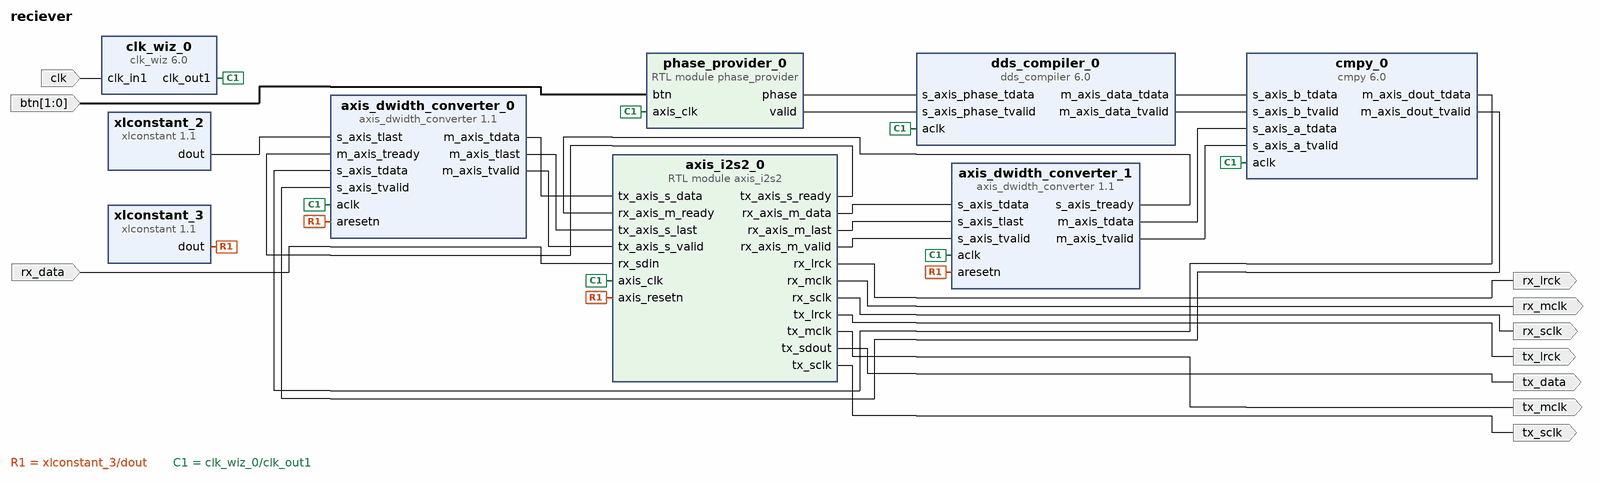
[diagram p0: block diagram of the top level]
# Vivado block design reciever, xc7s50csga324-1, Vivado 2023.2
create_bd_design reciever

create_bd_port -dir I -type clk clk
create_bd_port -dir O tx_mclk
create_bd_port -dir O tx_lrck
create_bd_port -dir O tx_sclk
create_bd_port -dir O tx_data
create_bd_port -dir O rx_mclk
create_bd_port -dir O rx_lrck
create_bd_port -dir O rx_sclk
create_bd_port -dir I rx_data
create_bd_port -dir I -from 1 -to 0 btn

create_bd_cell -type module -reference axis_i2s2 axis_i2s2_0
create_bd_cell -type ip -vlnv xilinx.com:ip:clk_wiz:6.0 clk_wiz_0
set_property -dict [list \
  CONFIG.CLKOUT1_JITTER 448.322 \
  CONFIG.CLKOUT1_PHASE_ERROR 335.207 \
  CONFIG.CLKOUT1_REQUESTED_OUT_FREQ 24.576 \
  CONFIG.MMCM_CLKFBOUT_MULT_F 34.250 \
  CONFIG.MMCM_CLKOUT0_DIVIDE_F 27.875 \
  CONFIG.MMCM_DIVCLK_DIVIDE 5 \
  CONFIG.USE_LOCKED false \
  CONFIG.USE_RESET false \
] [get_bd_cells clk_wiz_0]
create_bd_cell -type ip -vlnv xilinx.com:ip:dds_compiler:6.0 dds_compiler_0
set_property -dict [list \
  CONFIG.DATA_Has_TLAST Not_Required \
  CONFIG.DDS_Clock_Rate 24.576 \
  CONFIG.Frequency_Resolution 0.4 \
  CONFIG.Has_Phase_Out false \
  CONFIG.Has_TREADY false \
  CONFIG.Latency 3 \
  CONFIG.Latency_Configuration Configurable \
  CONFIG.M_DATA_Has_TUSER Not_Required \
  CONFIG.Noise_Shaping Auto \
  CONFIG.Output_Frequency1 0 \
  CONFIG.Output_Width 24 \
  CONFIG.PINC1 0 \
  CONFIG.Phase_Increment Streaming \
  CONFIG.Phase_Width 26 \
  CONFIG.S_PHASE_Has_TUSER Not_Required \
  CONFIG.Spurious_Free_Dynamic_Range 135 \
] [get_bd_cells dds_compiler_0]
create_bd_cell -type ip -vlnv xilinx.com:ip:axis_dwidth_converter:1.1 axis_dwidth_converter_0
set_property -dict [list \
  CONFIG.HAS_TLAST 1 \
  CONFIG.M_TDATA_NUM_BYTES 3 \
  CONFIG.S_TDATA_NUM_BYTES 6 \
] [get_bd_cells axis_dwidth_converter_0]
create_bd_cell -type ip -vlnv xilinx.com:ip:xlconstant:1.1 xlconstant_2
set_property -dict {CONFIG.CONST_VAL 1} [get_bd_cells xlconstant_2]
create_bd_cell -type ip -vlnv xilinx.com:ip:xlconstant:1.1 xlconstant_3
set_property -dict {CONFIG.CONST_VAL 1} [get_bd_cells xlconstant_3]
create_bd_cell -type module -reference phase_provider phase_provider_0
create_bd_cell -type ip -vlnv xilinx.com:ip:axis_dwidth_converter:1.1 axis_dwidth_converter_1
set_property -dict [list \
  CONFIG.HAS_TLAST 1 \
  CONFIG.M_TDATA_NUM_BYTES 6 \
  CONFIG.S_TDATA_NUM_BYTES 3 \
] [get_bd_cells axis_dwidth_converter_1]
create_bd_cell -type ip -vlnv xilinx.com:ip:cmpy:6.0 cmpy_0
set_property -dict [list \
  CONFIG.APortWidth 24 \
  CONFIG.BPortWidth 24 \
  CONFIG.LatencyConfig Manual \
  CONFIG.MinimumLatency 2 \
  CONFIG.OutputWidth 24 \
] [get_bd_cells cmpy_0]

# ---- connections ----

connect_bd_net [get_bd_pins xlconstant_3/dout] \
  [get_bd_pins axis_dwidth_converter_0/aresetn] [get_bd_pins axis_i2s2_0/axis_resetn] \
  [get_bd_pins axis_dwidth_converter_1/aresetn]
connect_bd_net [get_bd_pins axis_dwidth_converter_0/m_axis_tdata] [get_bd_pins axis_i2s2_0/tx_axis_s_data]
connect_bd_net [get_bd_pins axis_dwidth_converter_0/m_axis_tlast] [get_bd_pins axis_i2s2_0/tx_axis_s_last]
connect_bd_net [get_bd_pins axis_dwidth_converter_0/m_axis_tvalid] [get_bd_pins axis_i2s2_0/tx_axis_s_valid]
connect_bd_net [get_bd_pins axis_dwidth_converter_1/m_axis_tdata] [get_bd_pins cmpy_0/s_axis_a_tdata]
connect_bd_net [get_bd_pins axis_dwidth_converter_1/m_axis_tvalid] [get_bd_pins cmpy_0/s_axis_a_tvalid]
connect_bd_net [get_bd_pins axis_dwidth_converter_1/s_axis_tready] [get_bd_pins axis_i2s2_0/rx_axis_m_ready]
connect_bd_net [get_bd_pins axis_i2s2_0/rx_axis_m_data] [get_bd_pins axis_dwidth_converter_1/s_axis_tdata]
connect_bd_net [get_bd_pins axis_i2s2_0/rx_axis_m_last] [get_bd_pins axis_dwidth_converter_1/s_axis_tlast]
connect_bd_net [get_bd_pins axis_i2s2_0/rx_axis_m_valid] [get_bd_pins axis_dwidth_converter_1/s_axis_tvalid]
connect_bd_net [get_bd_pins axis_i2s2_0/rx_lrck] [get_bd_ports rx_lrck]
connect_bd_net [get_bd_pins axis_i2s2_0/rx_mclk] [get_bd_ports rx_mclk]
connect_bd_net [get_bd_pins axis_i2s2_0/rx_sclk] [get_bd_ports rx_sclk]
connect_bd_net [get_bd_pins axis_i2s2_0/tx_axis_s_ready] [get_bd_pins axis_dwidth_converter_0/m_axis_tready]
connect_bd_net [get_bd_pins axis_i2s2_0/tx_lrck] [get_bd_ports tx_lrck]
connect_bd_net [get_bd_pins axis_i2s2_0/tx_mclk] [get_bd_ports tx_mclk]
connect_bd_net [get_bd_pins axis_i2s2_0/tx_sclk] [get_bd_ports tx_sclk]
connect_bd_net [get_bd_pins axis_i2s2_0/tx_sdout] [get_bd_ports tx_data]
connect_bd_net -net btn_0_1 [get_bd_ports btn] [get_bd_pins phase_provider_0/btn]
connect_bd_net -net clk_in1_0_1 [get_bd_ports clk] [get_bd_pins clk_wiz_0/clk_in1]
connect_bd_net [get_bd_pins clk_wiz_0/clk_out1] \
  [get_bd_pins axis_i2s2_0/axis_clk] [get_bd_pins dds_compiler_0/aclk] [get_bd_pins axis_dwidth_converter_0/aclk] \
  [get_bd_pins phase_provider_0/axis_clk] [get_bd_pins axis_dwidth_converter_1/aclk] [get_bd_pins cmpy_0/aclk]
connect_bd_net [get_bd_pins cmpy_0/m_axis_dout_tdata] [get_bd_pins axis_dwidth_converter_0/s_axis_tdata]
connect_bd_net [get_bd_pins cmpy_0/m_axis_dout_tvalid] [get_bd_pins axis_dwidth_converter_0/s_axis_tvalid]
connect_bd_net [get_bd_pins dds_compiler_0/m_axis_data_tdata] [get_bd_pins cmpy_0/s_axis_b_tdata]
connect_bd_net [get_bd_pins dds_compiler_0/m_axis_data_tvalid] [get_bd_pins cmpy_0/s_axis_b_tvalid]
connect_bd_net [get_bd_pins phase_provider_0/phase] [get_bd_pins dds_compiler_0/s_axis_phase_tdata]
connect_bd_net [get_bd_pins phase_provider_0/valid] [get_bd_pins dds_compiler_0/s_axis_phase_tvalid]
connect_bd_net -net rx_sdin_0_1 [get_bd_ports rx_data] [get_bd_pins axis_i2s2_0/rx_sdin]
connect_bd_net [get_bd_pins xlconstant_2/dout] [get_bd_pins axis_dwidth_converter_0/s_axis_tlast]

validate_bd_design
save_bd_design
